# Altium schematic sheet IR_Sensor.SchDoc
size A4; SheetNumber: 4; SheetTotal: 7
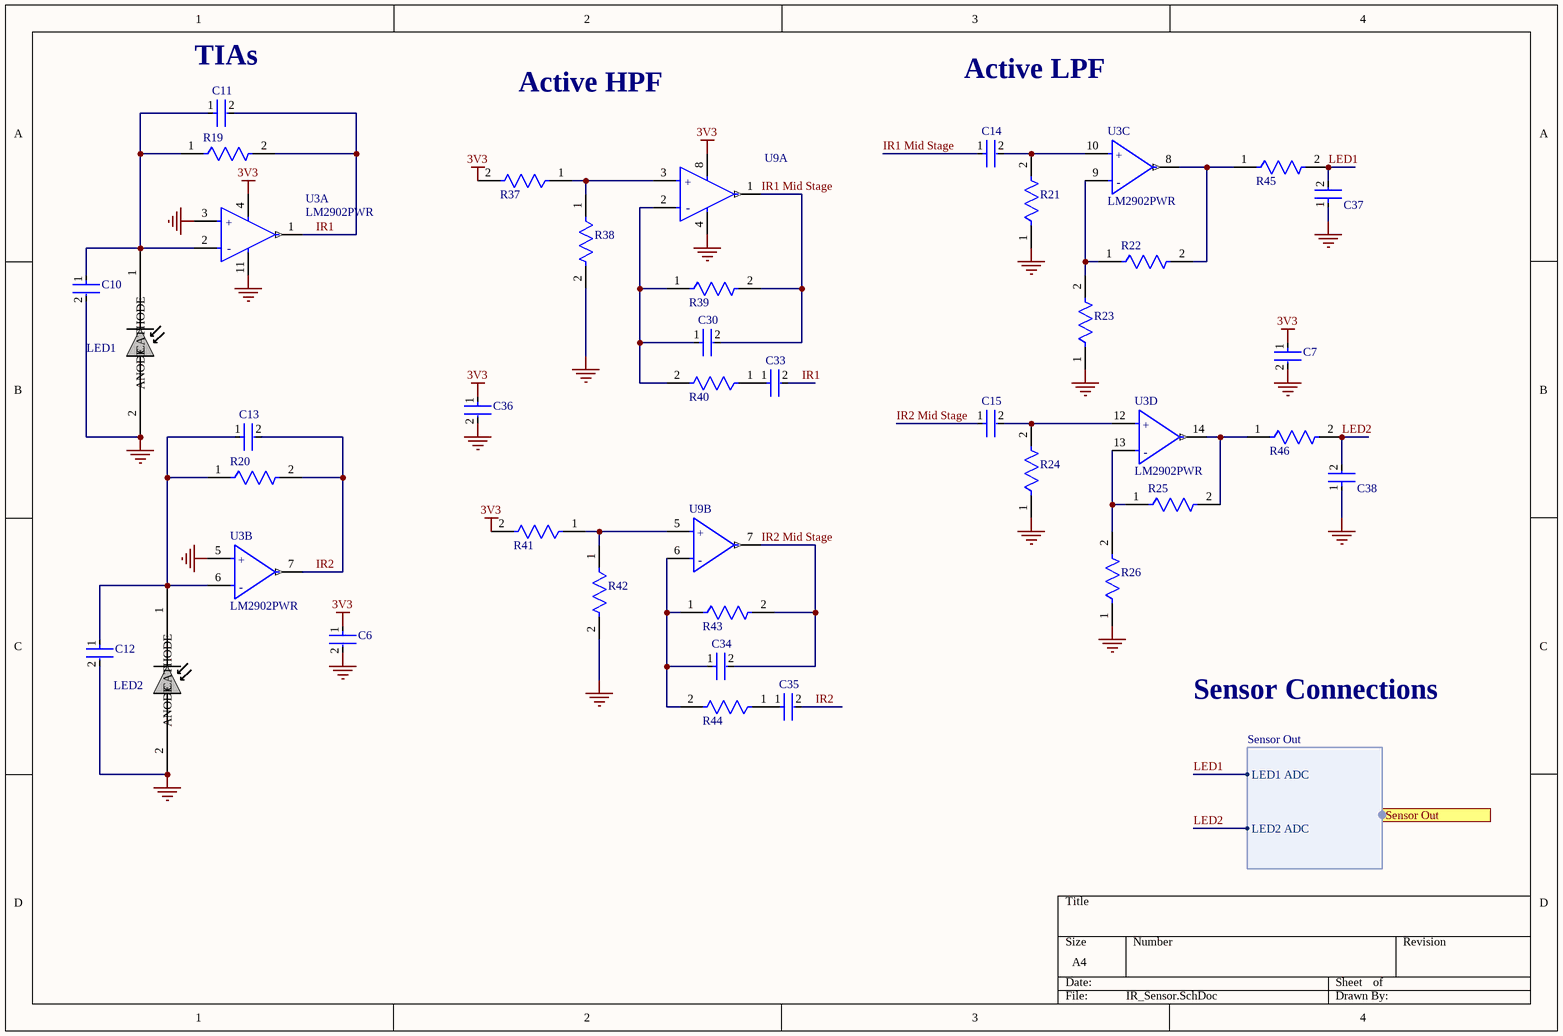
[diagram p0: IR_Sensor.SchDoc]

## Parts
C6  LMK105B7104KVHF  [FP-0402-L_1_0_0_05-W_0_5-IPC_B]  (value not drawn)
C7  LMK105B7104KVHF  [FP-0402-L_1_0_0_05-W_0_5-IPC_B]  (value not drawn)
C10  GCM1555C1H4R0CA16D  [FP-GCM155-0_05-MFG]  (value not drawn)
C11  C0603C100D5GACAUTO  [FP-C0603C-CF-MFG]  (value not drawn)
C12  GCM1555C1H4R0CA16D  [FP-GCM155-0_05-MFG]  (value not drawn)
C13  C0603C100D5GACAUTO  [FP-C0603C-CF-MFG]  (value not drawn)
C14  C0603C104K3RACTU  [FP-C0603C-CF-MFG]  (value not drawn)
C15  C0603C104K3RACTU  [FP-C0603C-CF-MFG]  (value not drawn)
C30  C0603C100D5GACAUTO  [FP-C0603C-CF-MFG]  (value not drawn)
C33  C0603C104K3RACTU  [FP-C0603C-CF-MFG]  (value not drawn)
C34  C0603C100D5GACAUTO  [FP-C0603C-CF-MFG]  (value not drawn)
C35  C0603C104K3RACTU  [FP-C0603C-CF-MFG]  (value not drawn)
C36  LMK105B7104KVHF  [FP-0402-L_1_0_0_05-W_0_5-IPC_B]  (value not drawn)
C37  C0603C104K3RACTU  [FP-C0603C-CF-MFG]  (value not drawn)
C38  C0603C104K3RACTU  [FP-C0603C-CF-MFG]  (value not drawn)
LED1  VEMD2020X01  [6p544-5383p02-4_VIS]  (value not drawn)
LED2  VEMD2020X01  [6p544-5383p02-4_VIS]  (value not drawn)
R19  MCT0603MD1002DP500  [FP-MCT0603-IPC_A]  (value not drawn)
R20  MCT0603MD1002DP500  [FP-MCT0603-IPC_A]  (value not drawn)
R21  AC0603JR-0747KL  [FP-AC0603-IPC_A]  (value not drawn)
R22  RT0603DRE073K3L  [FP-RT0603-MFG]  (value not drawn)
R23  AT0603BRD071KL  [FP-AT0603-IPC_A]  (value not drawn)
R24  AC0603JR-0747KL  [FP-AC0603-IPC_A]  (value not drawn)
R25  RT0603DRE073K3L  [FP-RT0603-MFG]  (value not drawn)
R26  AT0603BRD071KL  [FP-AT0603-IPC_A]  (value not drawn)
R37  CRCW0603100KFKEI  [FP-CRCW0603-e3-MFG]  (value not drawn)
R38  CRCW0603100KFKEI  [FP-CRCW0603-e3-MFG]  (value not drawn)
R39  CRCW0603100KFKEI  [FP-CRCW0603-e3-MFG]  (value not drawn)
R40  AC0603JR-7W10KL  [FP-AC0603-IPC_A]  (value not drawn)
R41  CRCW0603100KFKEI  [FP-CRCW0603-e3-MFG]  (value not drawn)
R42  CRCW0603100KFKEI  [FP-CRCW0603-e3-MFG]  (value not drawn)
R43  CRCW0603100KFKEI  [FP-CRCW0603-e3-MFG]  (value not drawn)
R44  AC0603JR-7W10KL  [FP-AC0603-IPC_A]  (value not drawn)
R45  CRCW0603100KFKEI  [FP-CRCW0603-e3-MFG]  (value not drawn)
R46  CRCW0603100KFKEI  [FP-CRCW0603-e3-MFG]  (value not drawn)
U3  LM2902PWR  [FP-PW0014A-IPC_C]  (parts A,B,C,D of 4)
U9  LMV358AIDR  [FP-D0008A-IPC_C]  (value not drawn)  (parts A,B of 2)

## Ports
Sensor Out (harness Sensor Out, see root[3B], Sensor_Controller[4C])

## Harnesses
Sensor Out: LED2 ADC, LED1 ADC

## Nets
3V3: C6.1 C7.1 C36.1 R37.2 R41.2 U3.4(VCC) U9.8(V+)
GND: C6.2 C7.2 C10.2 C12.2 C36.2 C37.1 C38.1 LED1.2(ANODE) LED2.2(ANODE) R21.1 R23.1 R24.1 R26.1 R38.2 R42.2 U3.3(1IN+) U3.5(2IN+) U3.11(GND) U9.4(V-)
IR1: C11.2 C33.2 R19.2 U3.1(1OUT)
IR1 Mid Stage: C14.1 C30.2 R39.2 U9.1(OUT_A)
IR2: C13.2 C35.2 R20.2 U3.7(2OUT)
IR2 Mid Stage: C15.1 C34.2 R43.2 U9.7(OUT_B)
LED1: C37.2 R45.2 ; port Sensor Out.LED1 ADC
LED2: C38.2 R46.2 ; port Sensor Out.LED2 ADC
NetC10_1: C10.1 C11.1 LED1.1(CATHODE) R19.1 U3.2(1IN-)
NetC12_1: C12.1 C13.1 LED2.1(CATHODE) R20.1 U3.6(2IN-)
NetC14_2: C14.2 R21.2 U3.10(3IN+)
NetC15_2: C15.2 R24.2 U3.12(4IN+)
NetC30_1: C30.1 R39.1 R40.2 U9.2(-IN_A)
NetC33_1: C33.1 R40.1
NetC34_1: C34.1 R43.1 R44.2 U9.6(-IN_B)
NetC35_1: C35.1 R44.1
NetR22_1: R22.1 R23.2 U3.9(3IN-)
NetR22_2: R22.2 R45.1 U3.8(3OUT)
NetR25_1: R25.1 R26.2 U3.13(4IN-)
NetR25_2: R25.2 R46.1 U3.14(4OUT)
NetR37_1: R37.1 R38.1 U9.3(+IN_A)
NetR41_1: R41.1 R42.1 U9.5(+IN_B)

## Notes on the sheet
- (near C11) TIAs
- Active HPF
- Active LPF
- Sensor Connections
- (in symbol CMP-04895-000145-1, part A) +; -
- (in symbol CMP-04895-000145-1, part B) +; -
- (in symbol CMP-04895-000145-1, part C) +; -
- (in symbol CMP-04895-000145-1, part D) +; -
- (in symbol CMP-04895-000233-1, part A) +; -
- (in symbol CMP-04895-000233-1, part B) +; -

## Library data of the parts
C6 C7 C36 = CMP-14477-001294-2: None; Tolerance: 10%; Voltage Rating: 10V; Capacitance: 100nF; Lead Free: Lead Free; Case/Package: 0402; Length: 0.039inch; Thickness: 0.022inch; Halogen Free: Halogen Free; Mount: Surface Mount; Packaging: Tape and Reel; Width: 0.02inch; Case Code (Metric): 1005; Voltage Rating (DC): 10V; Case Code (Imperial): 0402; Min Operating Temperature: -55°C; RoHS Compliant: Yes; Max Operating Temperature: 125°C; Ratings: AEC-Q200
C10 C12 = CMP-06035-062171-1: Ceramic Capacitor for Automotive 4pF ±0.25pF 50VDC C0G 0402 Paper T/R; Voltage Rating: 50V; Mount: Surface Mount; Min Operating Temperature: -55°C; Package Quantity: 10000; Case/Package: 0402; Case Code (Imperial): 0402; Thickness: 0.022inch; Dielectric: C0G; Length: 0.039inch; Ratings: AEC-Q200; Max Operating Temperature: 125°C; Voltage Rating (DC): 50V; Packaging: Tape and Reel; RoHS Compliant: Yes; Termination: SMD/SMT; Weight: 0.000212oz; Capacitance: 4pF; Case Code (Metric): 1005; Width: 0.02inch; Height: 0.5mm
C11 C13 C30 C34 = CMP-03020-010987-1: C0603 10 pF C0G 30ppm/°C 0.5 pF 50 V; Manufacturer: KEMET; Tolerance: 0.5 pF; Automotive Grade: Grade 1; Value: 10 pF; Material: Ceramic; Voltage Rating: 50 V; ComponentLink2URL: https://api.kemet.com/component-edge/download/datasheet/C0603C100J5GACAUTO.pdf; Manufacturer Part Number: C0603C100D5GACAUTO; Temperature Range High: +125°C; Height: 0.87mm; Device Class L3: Ceramic Capacitors; Octopart: https://octopart.com/c0603c100d5gacauto-kemet-81425946; RoHS: TRUE; Temperature: -55°C to +125°C; Lead Free: Yes; Temperature Characteristic: C0G; Category: Cap; ComponentLink2Description: Datasheet; Capacitance: 10 pF; Device Class L2: Capacitors; Temperature Coefficient: 30ppm/°C; Device Class L1: Passive Components; Automotive: Yes; Package: C0603C-CF; Temperature Range Low: -55°C
C14 C15 C33 C35 C37 C38 = CMP-2006-03057-2: CAP CER 0.1UF 25V X7R 0603; Manufacturer: KEMET; Value: 0.10 μF; Material: Ceramic; Tolerance: 0.1; Temperature Coefficient: 30ppm/°C; Automotive Grade: Grade 1; Lead Free: Yes; Device Class L3: Ceramic Capacitors; Voltage Rating: 25 V; Manufacturer Part Number: C0603C104K3RACTU; Digikey Description: CAP CER 0.1UF 25V X7R 0603; Mouser Description: Multilayer Ceramic Capacitors MLCC - SMD/SMT 25volts 0.1uF X7R 10%; Package: C0603C-CF; Temperature Range Low: -55°C; Automotive: Yes; Device Class L2: Capacitors; Octopart: https://octopart.com/c0603c104k3ractu-kemet-127541; ComponentLink2Description: Datasheet; ComponentLink2URL: https://api.kemet.com/component-edge/download/datasheet/C0603C100J5GACAUTO.pdf; Temperature Range High: +125°C; RoHS: TRUE; Device Class L1: Passive Components; Category: Cap; Temperature: -55°C to +125°C; Capacitance: 0.10 μF; Height: 0.87mm; Temperature Characteristic: X7R
LED1 LED2 = VEMD2020X01: No Description Available; Mfr_Name: Vishay; RefDes: RefDes; Type: Type
R19 R20 = CMP-02407-010942-1: RES SMD 100 OHM 1% 1/8W 0603; Power Rating: 125mW; Resistance: 10kR; Tolerance: 0.5%; Temperature Coefficient: 25ppm/°C; Max Power Dissipation: 150mW; Voltage Rating: 75V; Case Code (Imperial): 0603; Case Code (Metric): 1608; Military Standard: Not; Lead Free: Lead Free; Max Operating Temperature: 175°C; Length: 1.55mm; Height: 0.022inch; Min Operating Temperature: -55°C; Width: 0.8mm; Package Quantity: 1; Contact Plating: Tin; Termination: Wraparound; Composition: Thin Film; Case/Package: 0603; Number of Terminations: 2; Depth: 0.85mm; Features: Automotive AEC-Q200; Mount: Surface Mount; Voltage Rating (DC): 75V; Packaging: Tape and Reel; REACH SVHC: No SVHC
R21 R24 = CMP-03412-049221-1: RES 47kΩ 5.00% 0.1W 0603; Resistance: 47kR; Tolerance: 5%; Temperature Coefficient: 100ppm/°C; Max Power Dissipation: 100mW; Voltage Rating: 50V; Packaging: Tape and Reel; Series: AC; Ratings: AEC-Q200; Case Code (Metric): 1608; Case Code (Imperial): 0603; Resistor Type: Thick Film; Max Operating Temperature: 155°C; Case/Package: 0603; Features: Moisture Resistant; Height: 0.45mm; Termination: SMD/SMT; Length: 1.6mm; Min Operating Temperature: -55°C; Number of Terminations: 2; Width: 0.8mm; RoHS Compliant: Yes; Power Rating: 100mW
R22 R25 = CMP-03412-032896-1: RES 3.30K OHM 1/10W .5% SMD 0603; Manufacturer: Yageo; Resistance: 3.3KΩ; Value: 3.3KΩ; Voltage Rating: 75V; Power Rating: 0.1W; Tolerance: 0.005; Temperature Coefficient: 50 ppm/°C; Composition: Thin Film; Ipc Land Pattern Name: RESC16080X45; ComponentLink2URL: http://www.yageo.com/documents/recent/PYu-RT_1-to-0.01_RoHS_L_9.pdf; Mouser Description: High Precision-High Stability Chip Resistor Thin Film 0603 3.3kOhm 0.5% Paper T/R; Automotive: No; Temperature Range High: +155°C; Device Class L3: Chip SMD Resistors; RoHS: TRUE; Lead Free: Yes; Octopart: https://octopart.com/rt0603dre073k3l-yageo-1479702; Series: RT; Digikey Description: RES 3.30K OHM 1/10W .5% SMD 0603; Device Class L2: Resistors; Manufacturer Part Number: RT0603DRE073K3L; Temperature Range Low: -55°C; Package: RT0603; Category: Res; Footprint Url: http://www.yageo.com/exep/pages/download/literatures/PYu-R_Mount_10.pdf; Temperature: -55°C to +155°C; ComponentLink2Description: Datasheet; Height: 0.55mm; Device Class L1: Passive Components
R23 R26 = CMP-03412-045054-1: Thin Film Chip Resistors Automotive Grade 1kΩ 0.1% 25ppm/°C 0603; Resistance: 1kR; Max Power Dissipation: 100mW; RoHS Compliant: Yes; Case Code (Metric): 1608; Features: Moisture Resistant; Tolerance: 0.1%; Case/Package: 0603; Temperature Coefficient: 25ppm/°C; Height: 0.022inch; Max Operating Temperature: 155°C; Width: 0.032inch; Ratings: AEC-Q200; Series: AT; Length: 0.063inch; Case Code (Imperial): 0603; Packaging: Cut Tape; Resistor Type: Thin Film; Number of Terminations: 2; Min Operating Temperature: -55°C
R37-R39 R41-R43 R45 R46 = CMP-02407-005189-1: RES Thick Film, 100kΩ, 1%, 0.1W, 100ppm/°C, 0603; Resistance: 100kR; Max Power Dissipation: 100mW; Number of Terminations: 2; Temperature Coefficient: 100ppm/°C; Composition: Thick Film; Max Operating Temperature: 155°C; Packaging: Tape and Reel; Lead Free: Lead Free; Min Operating Temperature: -55°C; Case/Package: 0603; Tolerance: 1%; Height: 0.02inch; Length: 0.061inch; Package Quantity: 5000; Width: 0.033inch; Features: Automotive AEC-Q200
R40 R44 = CMP-03412-040683-1: RES 10kΩ 5.00% 0.2W 0603
U3 = CMP-04895-000145-1: IC OPAMP GP 4 CIRCUIT 14TSSOP; Min Supply Voltage: 3V; Operating Supply Voltage: 13V; Unity Gain Bandwidth Product: 1.2MHz; Slew Rate: 0.5V/µs; Dual Supply Voltage: 9V; Voltage Gain: 100dB; Common Mode Rejection Ratio: 50dB; Input Offset Voltage (Vos): 7mV; Operating Supply Current: 1.4mA; Min Dual Supply Voltage: 1.5V; Number of Channels: 4; Output Current per Channel: 60mA; Output Current: 30mA; Nominal Supply Current: 3mA; Input Bias Current: 250nA; Max Supply Voltage: 26V; Min Operating Temperature: -40°C; Max Operating Temperature: 125°C; Mount: Surface Mount; REACH SVHC: No SVHC; Max Dual Supply Voltage: 13V; Lead Free: Lead Free; Number of Pins: 14; Length: 5mm; Width: 4.4mm; Gain Bandwidth Product: 1.2MHz; Height: 1.15mm; Radiation Hardening: No; Package Quantity: 1; Number of Circuits: 4; Packaging: Tape and Reel; Bandwidth: 1.2MHz; Case/Package: TSSOP; Number of Amplifiers: 4; Number of Elements: 4
U9 = CMP-04895-000233-1: IC OPAMP GP 2 CIRCUIT 8SOIC; Gain Bandwidth Product: 1MHz; Number of Channels: 2; Input Offset Voltage (Vos): 1mV; Operating Supply Current: 80uA; Input Bias Current: 10pA; Slew Rate: 1.7V/µs; Min Operating Temperature: -40°C; Number of Circuits: 2; Packaging: Cut Tape; Case/Package: SOIC; RoHS Compliant: Yes; Number of Pins: 8; Mount: Surface Mount; Max Operating Temperature: 125°C